# Altium schematic sheet Main.SchDoc
size A4; SheetNumber: 1; SheetTotal: 4
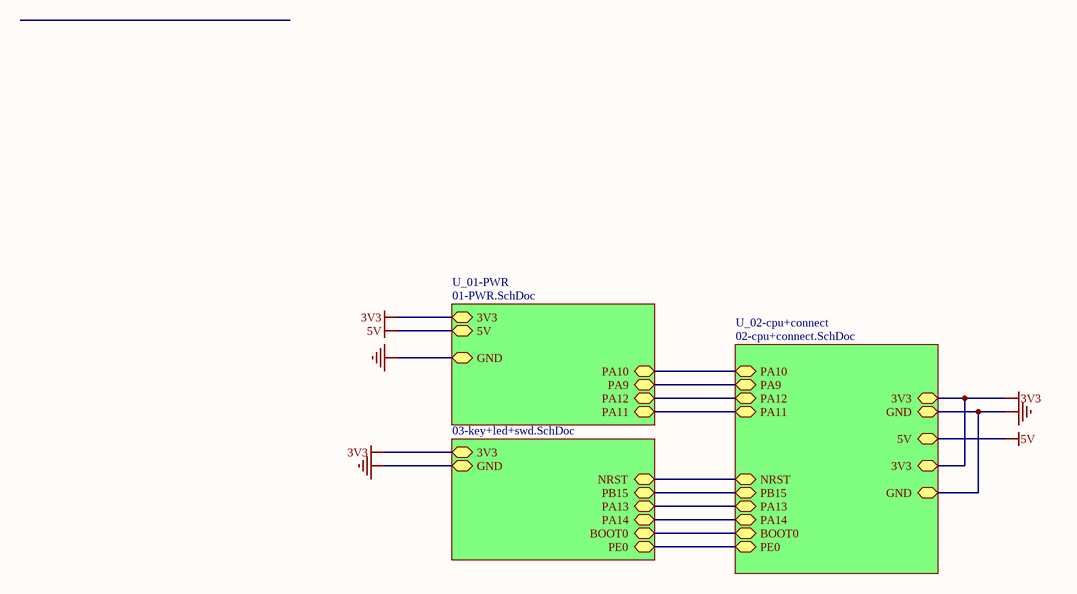
[diagram p0: Main.SchDoc]

## Sub-sheets
U_01-PWR = 01-PWR.SchDoc: 3V3 (bidir), 5V (bidir), GND (bidir), PA10 (bidir), PA9 (bidir), PA12 (bidir), PA11 (bidir)
U_02-cpu+connect = 02-cpu+connect.SchDoc: 3V3 (bidir), GND (bidir), NRST (bidir), PB15 (bidir), PA13 (bidir), PA14 (bidir), BOOT0 (bidir), PE0 (bidir), 3V3 (bidir), 5V (bidir), GND (bidir), PA10 (bidir), PA9 (bidir), PA12 (bidir), PA11 (bidir)
U_03-key+led+swd = 03-key+led+swd.SchDoc: 3V3 (bidir), GND (bidir), NRST (bidir), PB15 (bidir), PA13 (bidir), PA14 (bidir), BOOT0 (bidir), PE0 (bidir)

## Nets
3V3: sheet U_03-key+led+swd/3V3, sheet U_01-PWR/3V3, sheet U_02-cpu+connect/3V3, sheet U_02-cpu+connect/3V3
5V: sheet U_01-PWR/5V, sheet U_02-cpu+connect/5V
GND: sheet U_03-key+led+swd/GND, sheet U_01-PWR/GND, sheet U_02-cpu+connect/GND, sheet U_02-cpu+connect/GND
(unnamed): sheet U_03-key+led+swd/NRST, sheet U_02-cpu+connect/NRST
(unnamed): sheet U_03-key+led+swd/PB15, sheet U_02-cpu+connect/PB15
(unnamed): sheet U_03-key+led+swd/PA13, sheet U_02-cpu+connect/PA13
(unnamed): sheet U_03-key+led+swd/PA14, sheet U_02-cpu+connect/PA14
(unnamed): sheet U_03-key+led+swd/BOOT0, sheet U_02-cpu+connect/BOOT0
(unnamed): sheet U_03-key+led+swd/PE0, sheet U_02-cpu+connect/PE0
(unnamed): sheet U_01-PWR/PA10, sheet U_02-cpu+connect/PA10
(unnamed): sheet U_01-PWR/PA9, sheet U_02-cpu+connect/PA9
(unnamed): sheet U_01-PWR/PA12, sheet U_02-cpu+connect/PA12
(unnamed): sheet U_01-PWR/PA11, sheet U_02-cpu+connect/PA11